# EAGLE design RGF_1_0 (EAGLE 8.3.2)
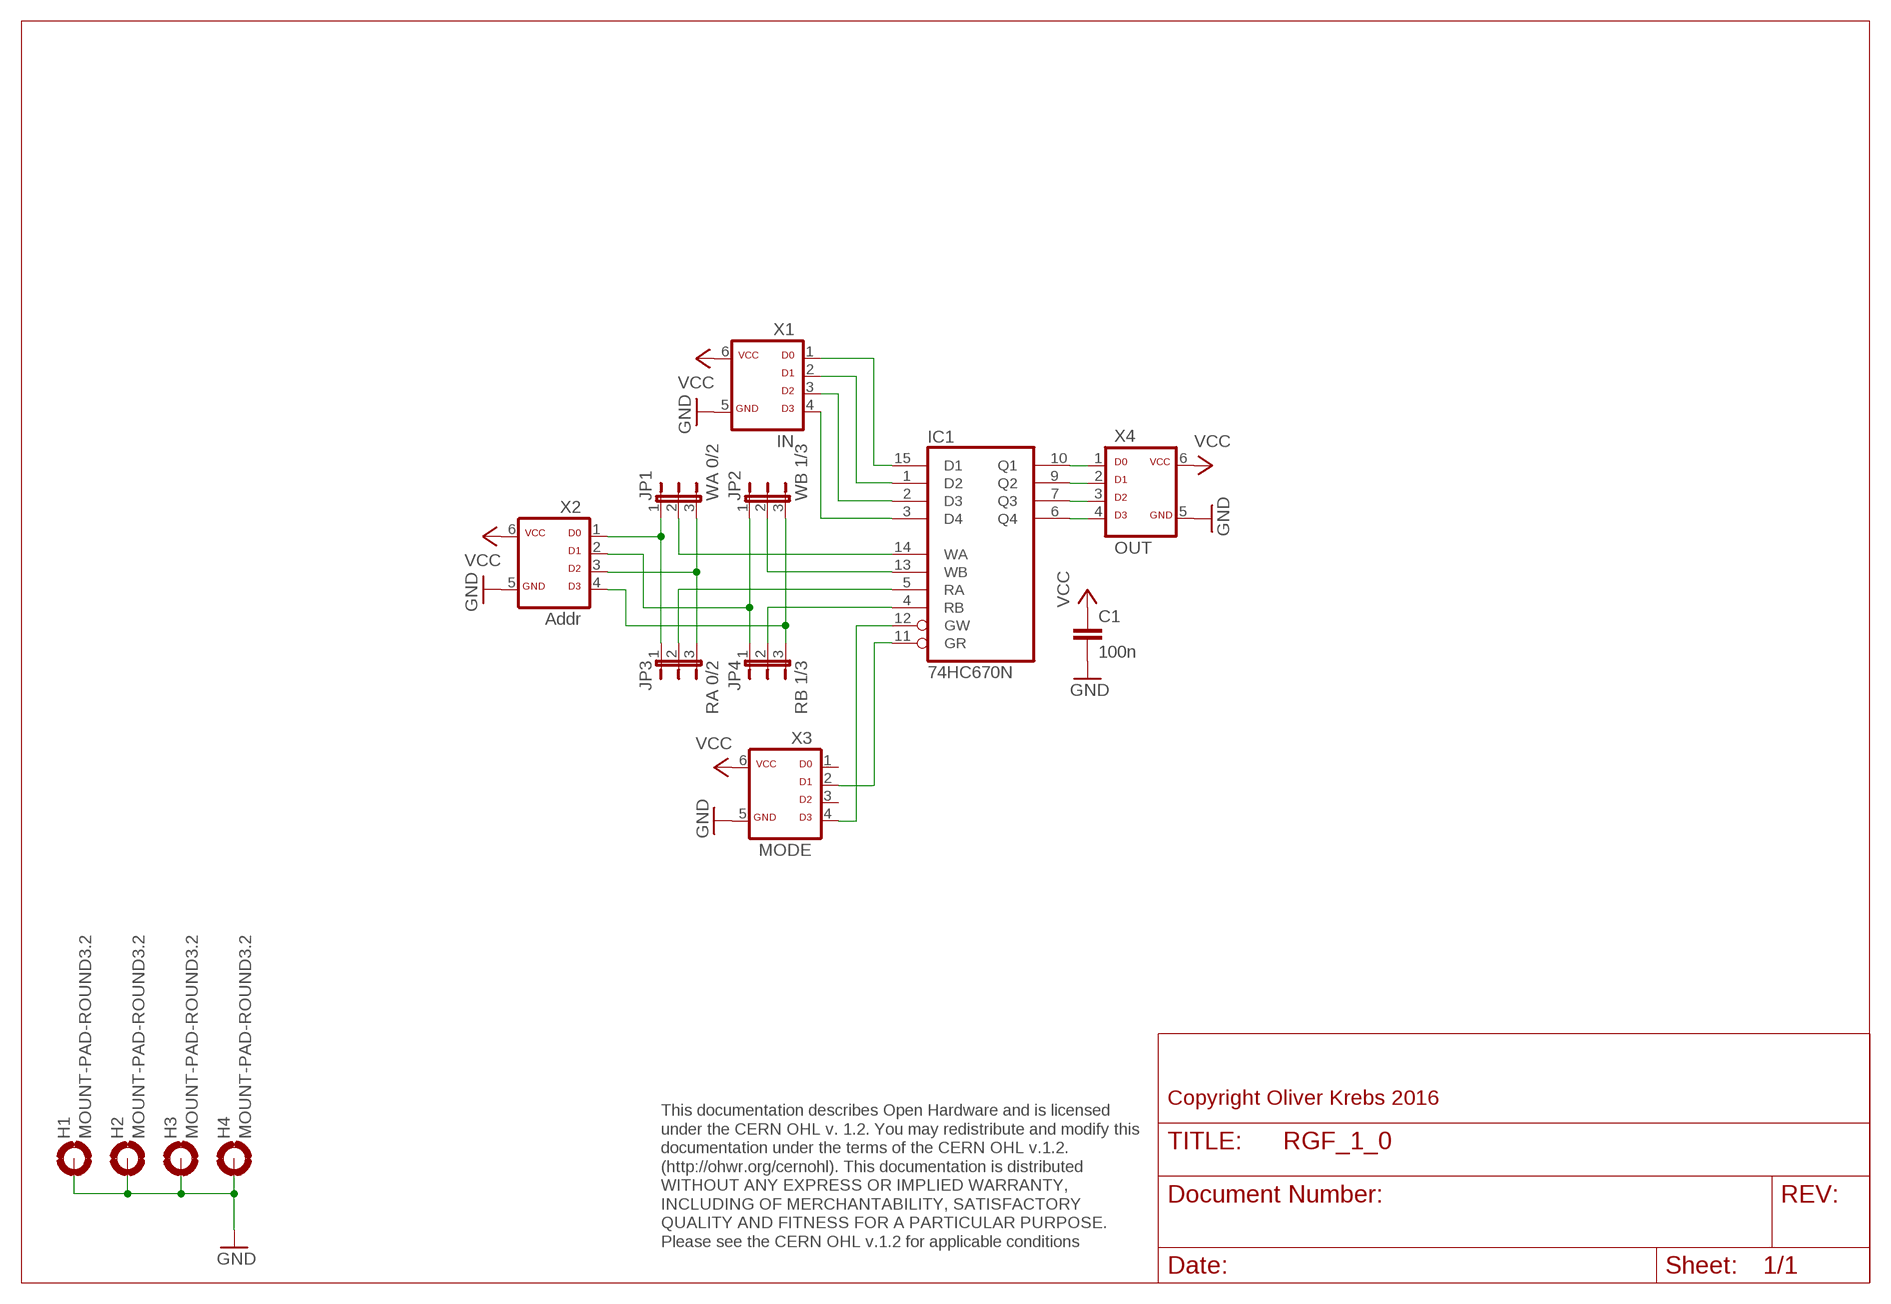
[diagram p0: schematic, sheet 1]

## Parts
C1  100n  C-EU050-025X075  [C050-025X075]
H1  MOUNT-PAD-ROUND3.2  [3,2-PAD]
H2  MOUNT-PAD-ROUND3.2  [3,2-PAD]
H3  MOUNT-PAD-ROUND3.2  [3,2-PAD]
H4  MOUNT-PAD-ROUND3.2  [3,2-PAD]
IC1  74HC670N  [DIL16]
JP1  WA 0/2  JP2E  [JP2]
JP2  WB 1/3  JP2E  [JP2]
JP3  RA 0/2  JP2E  [JP2]
JP4  RB 1/3  JP2E  [JP2]
X1  IN  ML6D  [ML-6]
X2  Addr  ML6D  [ML-6]
X3  MODE  ML6D  [ML-6]
X4  OUT  ML6D  [ML-6]

## Nets
GND: C1.2 H1.B3,2(MOUNT) H2.B3,2(MOUNT) H3.B3,2(MOUNT) H4.B3,2(MOUNT) X1.5 X2.5 X3.5 X4.5
N$1: IC1.15(D1) X1.1
N$2: IC1.1(D2) X1.2
N$3: IC1.2(D3) X1.3
N$4: IC1.3(D4) X1.4
N$5: IC1.9(Q2) X4.2
N$6: IC1.10(Q1) X4.1
N$7: IC1.7(Q3) X4.3
N$8: IC1.6(Q4) X4.4
N$9: JP1.1 JP3.1 X2.1
N$10: JP1.3 JP3.3 X2.3
N$11: IC1.14(WA) JP1.2
N$12: IC1.13(WB) JP2.2
N$13: JP2.3 JP4.3 X2.4
N$14: JP2.1 JP4.1 X2.2
N$15: IC1.4(RB) JP4.2
N$16: IC1.5(RA) JP3.2
N$22: IC1.12(GW) X3.4
N$23: IC1.11(GR) X3.2
VCC: C1.1 X1.6 X2.6 X3.6 X4.6
Unconnected: X3.1 X3.3

## Notes on the sheet
- Copyright Oliver Krebs 2016
- This documentation describes Open Hardware and is licensed 
  under the CERN OHL v. 1.2. You may redistribute and modify this 
  documentation under the terms of the CERN OHL v.1.2. 
  (http://ohwr.org/cernohl). This documentation is distributed
  WITHOUT ANY EXPRESS OR IMPLIED WARRANTY, 
  INCLUDING OF MERCHANTABILITY, SATISFACTORY 
  QUALITY AND FITNESS FOR A PARTICULAR PURPOSE. 
  Please see the CERN OHL v.1.2 for applicable conditions

## Power pins joined to a net without a drawn wire
GND: IC1.8(GND)
VCC: IC1.16(VCC)

## Library data of the parts
C1 = 01-my_rcl:C-EU: CAPACITOR, European symbol
H1-H4 = holes:MOUNT-PAD-ROUND: MOUNTING PAD, round
IC1 = 74xx-eu:74*670: 4 by 4 REGISTER FILES, 3-state
JP1-JP4 = jumper:JP2E: JUMPER
X1-X4 = 01-my-con:ML6D

## Board
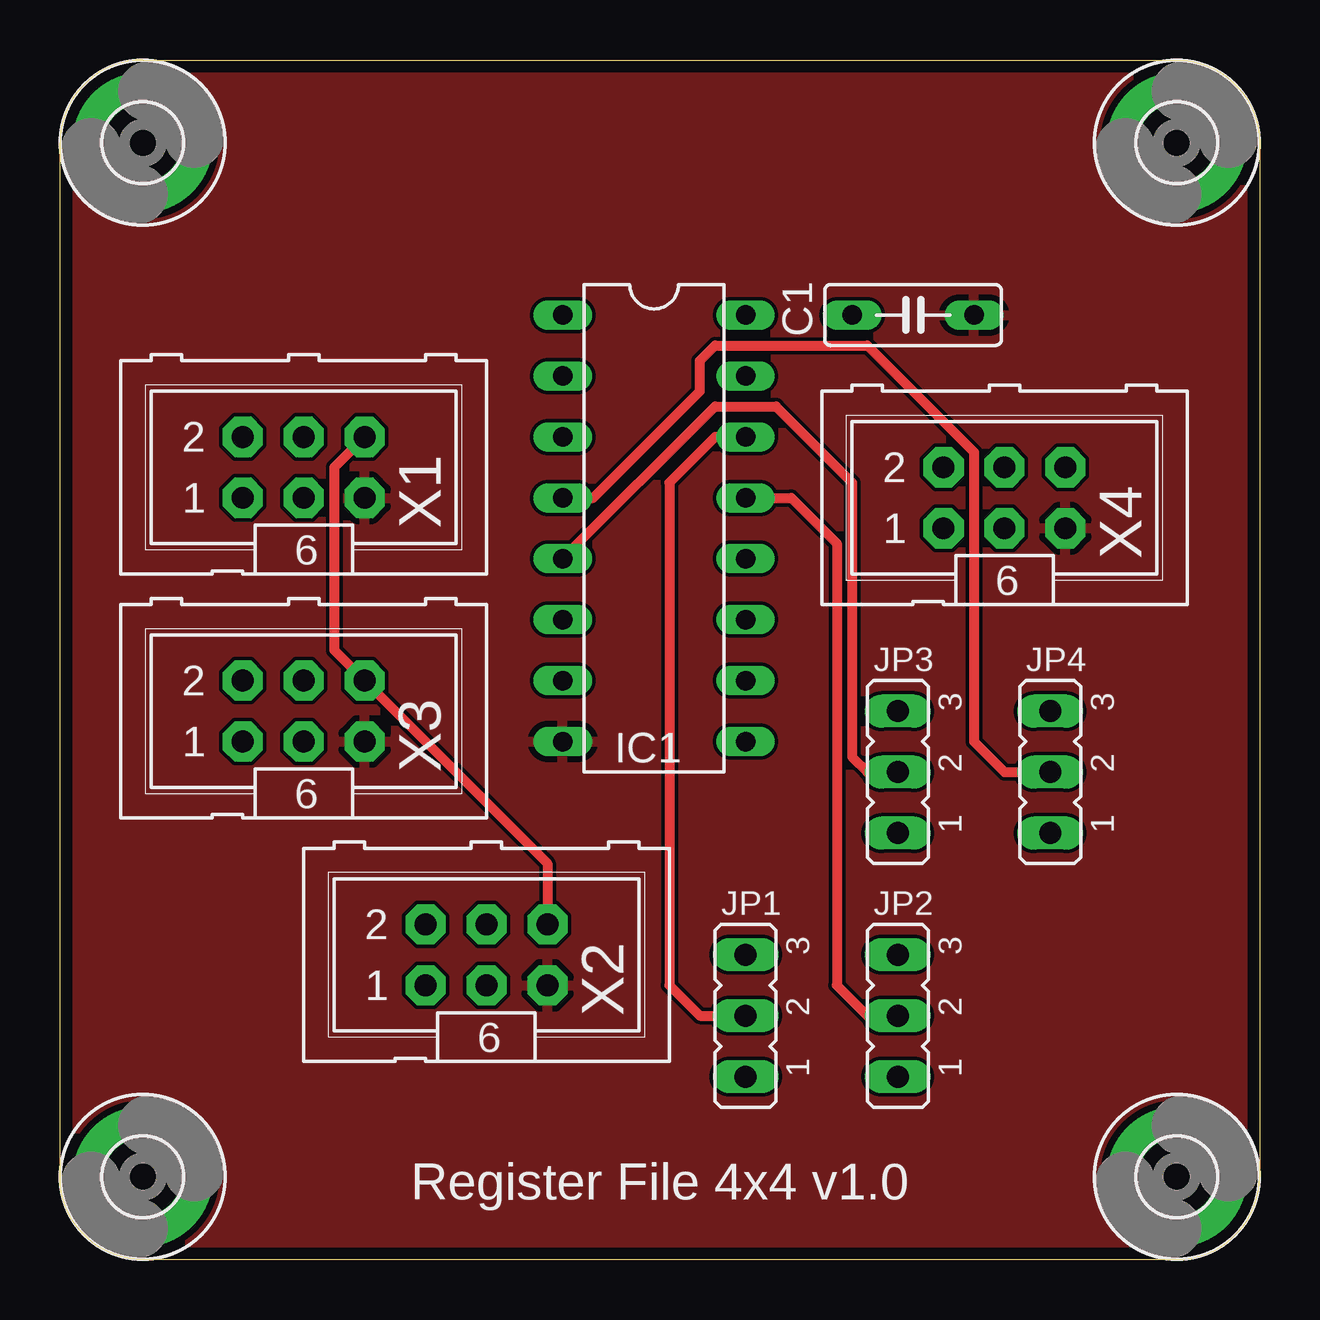
[diagram p1: board, top side]
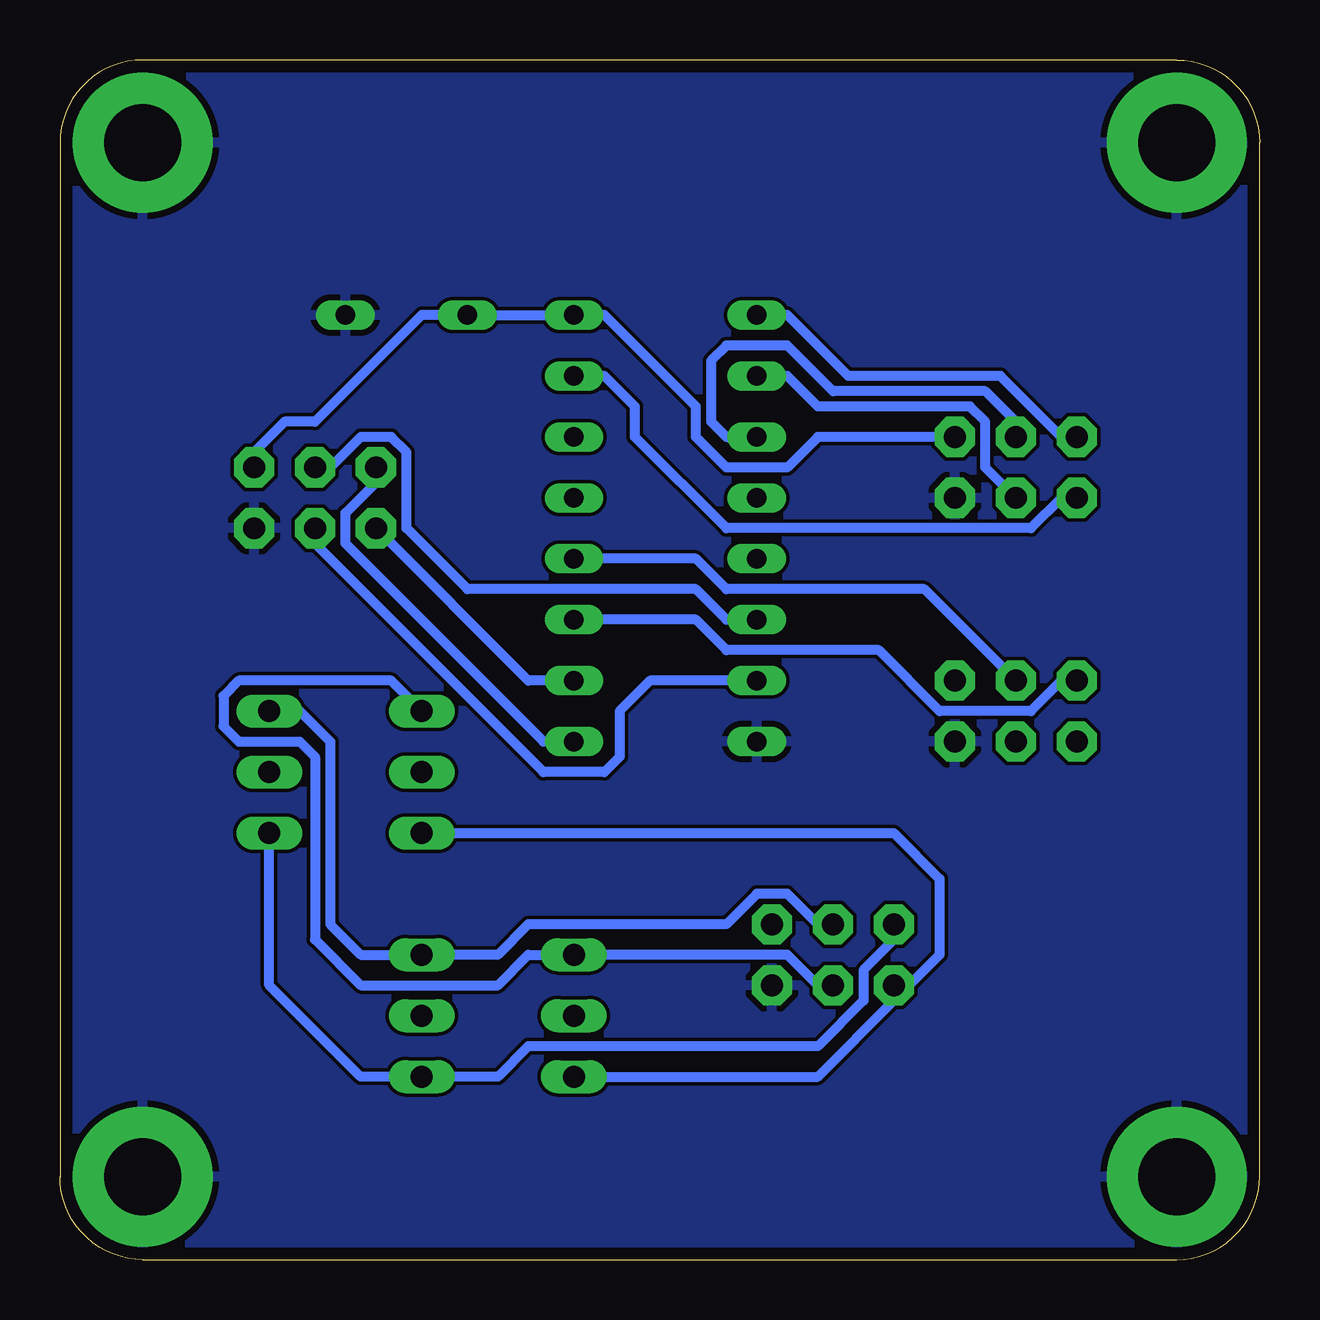
[diagram p2: board, bottom side, seen from below]

Size 50 x 50 mm. Coordinates in mm from the lower left corner, seen from the top.
Outline: 0,3.45 0,46.55 arc-90 3.45,50 46.55,50 arc-90 50,46.55 50,3.45 arc-90 46.55,0 3.45,0 arc-90 0,3.45
Copper layers (1*16): Top 0.035mm / dielectric 1.6mm / Bottom 0.035mm
Design rules "Elecrow_2-layer_PCB_eagle_rule": minimum track width 6mil, minimum drill 12mil, track to track 6mil, track to pad 6mil, pad to pad 6mil, via to via 8mil, smd to smd 0mil, copper to edge 20mil, drill to drill 10mil, minimum pad ring 6mil, minimum via ring 6mil, stop-mask expansion 0mil, vias tented up to drill 100mil, thermal gap 10mil

### Footprints (pad centres in the part's own frame; a part is rotated, then mirrored left to right if it is on the bottom)
C050-025X075 = drill 0.813 long: 1 -2.54,0; 2 2.54,0
3,2-PAD = drill 3.2 pad 5.842: B3,2 0,0
DIL16 = drill 0.813 long: 1 -8.89,-3.81; 2 -6.35,-3.81; 3 -3.81,-3.81; 4 -1.27,-3.81; 5 1.27,-3.81; 6 3.81,-3.81; 7 6.35,-3.81; 8 8.89,-3.81; 9 8.89,3.81; 10 6.35,3.81; 11 3.81,3.81; 12 1.27,3.81; 13 -1.27,3.81; 14 -3.81,3.81; 15 -6.35,3.81; 16 -8.89,3.81
JP2 = drill 0.914 long: 1 -2.54,0; 2 0,0; 3 2.54,0
ML-6 = drill 0.914 pad 1.676 octagon: 1 -2.54,-1.27; 2 -2.54,1.27; 3 0,-1.27; 4 0,1.27; 5 2.54,-1.27; 6 2.54,1.27

### Placement (x,y rotation side)
C1  35.56,39.37 0 top
H1  3.45,3.45 0 top
H2  3.45,46.55 0 top
H3  46.55,46.55 0 top
H4  46.55,3.45 0 top
IC1  24.77,30.48 270 top
JP1  28.57,10.16 90 top
JP2  34.92,10.16 90 top
JP3  34.92,20.32 90 top
JP4  41.27,20.32 90 top
X1  10.16,33.02 0 top
X2  17.78,12.7 0 top
X3  10.16,22.86 0 top
X4  39.37,31.75 0 top

### Tracks (layer width: path | path; a pad name or v marks a point on that pad's centre or on a via)
GND
  pour Bottom: 0,50.16 50.16,50.16 50.16,0 0,0
  pour Top: 0,50.16 50.16,50.16 50.16,0 0,0
N$1
  Bottom 0.406: X1.1 8.26,31.75 9.53,30.48 22.23,30.48 26.04,34.29 26.04,35.56 27.3,36.83 IC1.15
N$2
  Bottom 0.406: X1.2 8.26,34.29 10.79,36.83 17.14,36.83 19.68,39.37 IC1.1
N$3
  Bottom 0.406: X1.3 11.43,33.02 11.43,34.92 12.06,35.56 18.41,35.56 19.68,36.83 IC1.2
N$4
  Bottom 0.406: X1.4 10.16,34.92 11.43,36.2 17.78,36.2 19.68,38.1 22.23,38.1 22.86,37.47 22.86,34.92 22.23,34.29 IC1.3
N$5
  Bottom 0.406: IC1.9 29.84,21.59 38.1,29.84 38.1,31.11 36.83,32.38 X4.2
N$6
  Bottom 0.406: IC1.10 30.48,24.13 X4.1
N$7
  Bottom 0.406: IC1.7 25.4,24.13 26.67,22.86 26.67,20.95 27.3,20.32 29.84,20.32 39.37,29.84 X4.3
N$8
  Bottom 0.406: IC1.6 22.23,26.67 23.5,27.94 33.02,27.94 35.56,30.48 35.56,33.66 36.2,34.29 37.47,34.29 38.73,33.02 X4.4
N$9
  Bottom 0.406: JP1.1 18.41,7.62 15.24,10.79 | JP3.1 15.24,17.78 13.34,15.88 13.34,12.7 15.24,10.79 | 15.24,10.79 X2.1
N$10
  Bottom 0.406: X2.3 18.41,11.43 19.68,12.7 JP1.3 30.48,12.7 31.75,11.43 37.47,11.43 39.37,13.34 39.37,20.95 40.01,21.59 42.55,21.59 43.18,22.23 43.18,23.5 42.55,24.13 36.2,24.13 JP3.3
N$11
  Top 0.406: IC1.14 27.3,34.29 25.4,32.38 25.4,11.43 26.67,10.16 JP1.2
N$12
  Top 0.406: IC1.13 30.48,31.75 32.38,29.84 32.38,11.43 33.66,10.16 JP2.2
N$13
  Bottom 0.406: X2.4 18.41,13.97 19.68,15.24 20.95,15.24 22.23,13.97 30.48,13.97 31.75,12.7 JP2.3 37.47,12.7 38.73,13.97 38.73,21.59 40.01,22.86 JP4.3
N$14
  Bottom 0.406: X2.2 15.24,13.34 16.51,12.06 16.51,10.79 18.41,8.89 30.48,8.89 31.75,7.62 JP2.1 37.47,7.62 41.27,11.43 JP4.1
N$15
  Top 0.406: JP4.2 39.37,20.32 38.1,21.59 38.1,33.66 33.66,38.1 27.3,38.1 26.67,37.47 26.67,36.2 22.23,31.75 IC1.4
N$16
  Top 0.406: IC1.5 27.3,35.56 29.84,35.56 33.02,32.38 33.02,20.95 33.66,20.32 JP3.2
N$22
  Bottom 0.406: X3.4 13.97,27.94 22.23,27.94 23.5,29.21 IC1.12
N$23
  Bottom 0.406: X3.2 8.26,24.13 9.53,22.86 13.34,22.86 15.88,25.4 22.23,25.4 23.5,26.67 IC1.11
VCC
  Top 0.406: X1.6 11.43,33.02 11.43,25.4 X3.6 20.32,16.51 X2.6
  Bottom 0.406: X1.6 18.41,34.29 19.68,33.02 22.23,33.02 23.5,34.29 23.5,35.56 27.3,39.37 IC1.16 C1.1 34.92,39.37 39.37,34.92 40.64,34.92 41.91,33.66 X4.6

### Text on the board
tNames: Register File 4x4 v1.0
200bmp: E:/Bilder/Elektronik/Modulion/Mexdulon/mexdulon_50x50_pcb.bmp